# EasyEDA schematic Drop_sensor.json
TITLE: Drop_sensor for water drop screen and/or UV cure exhebit; REV: 1.0; Date: 2022-09-07; Sheet: 1/1; Drawn By: AmirB; Company: Your Company
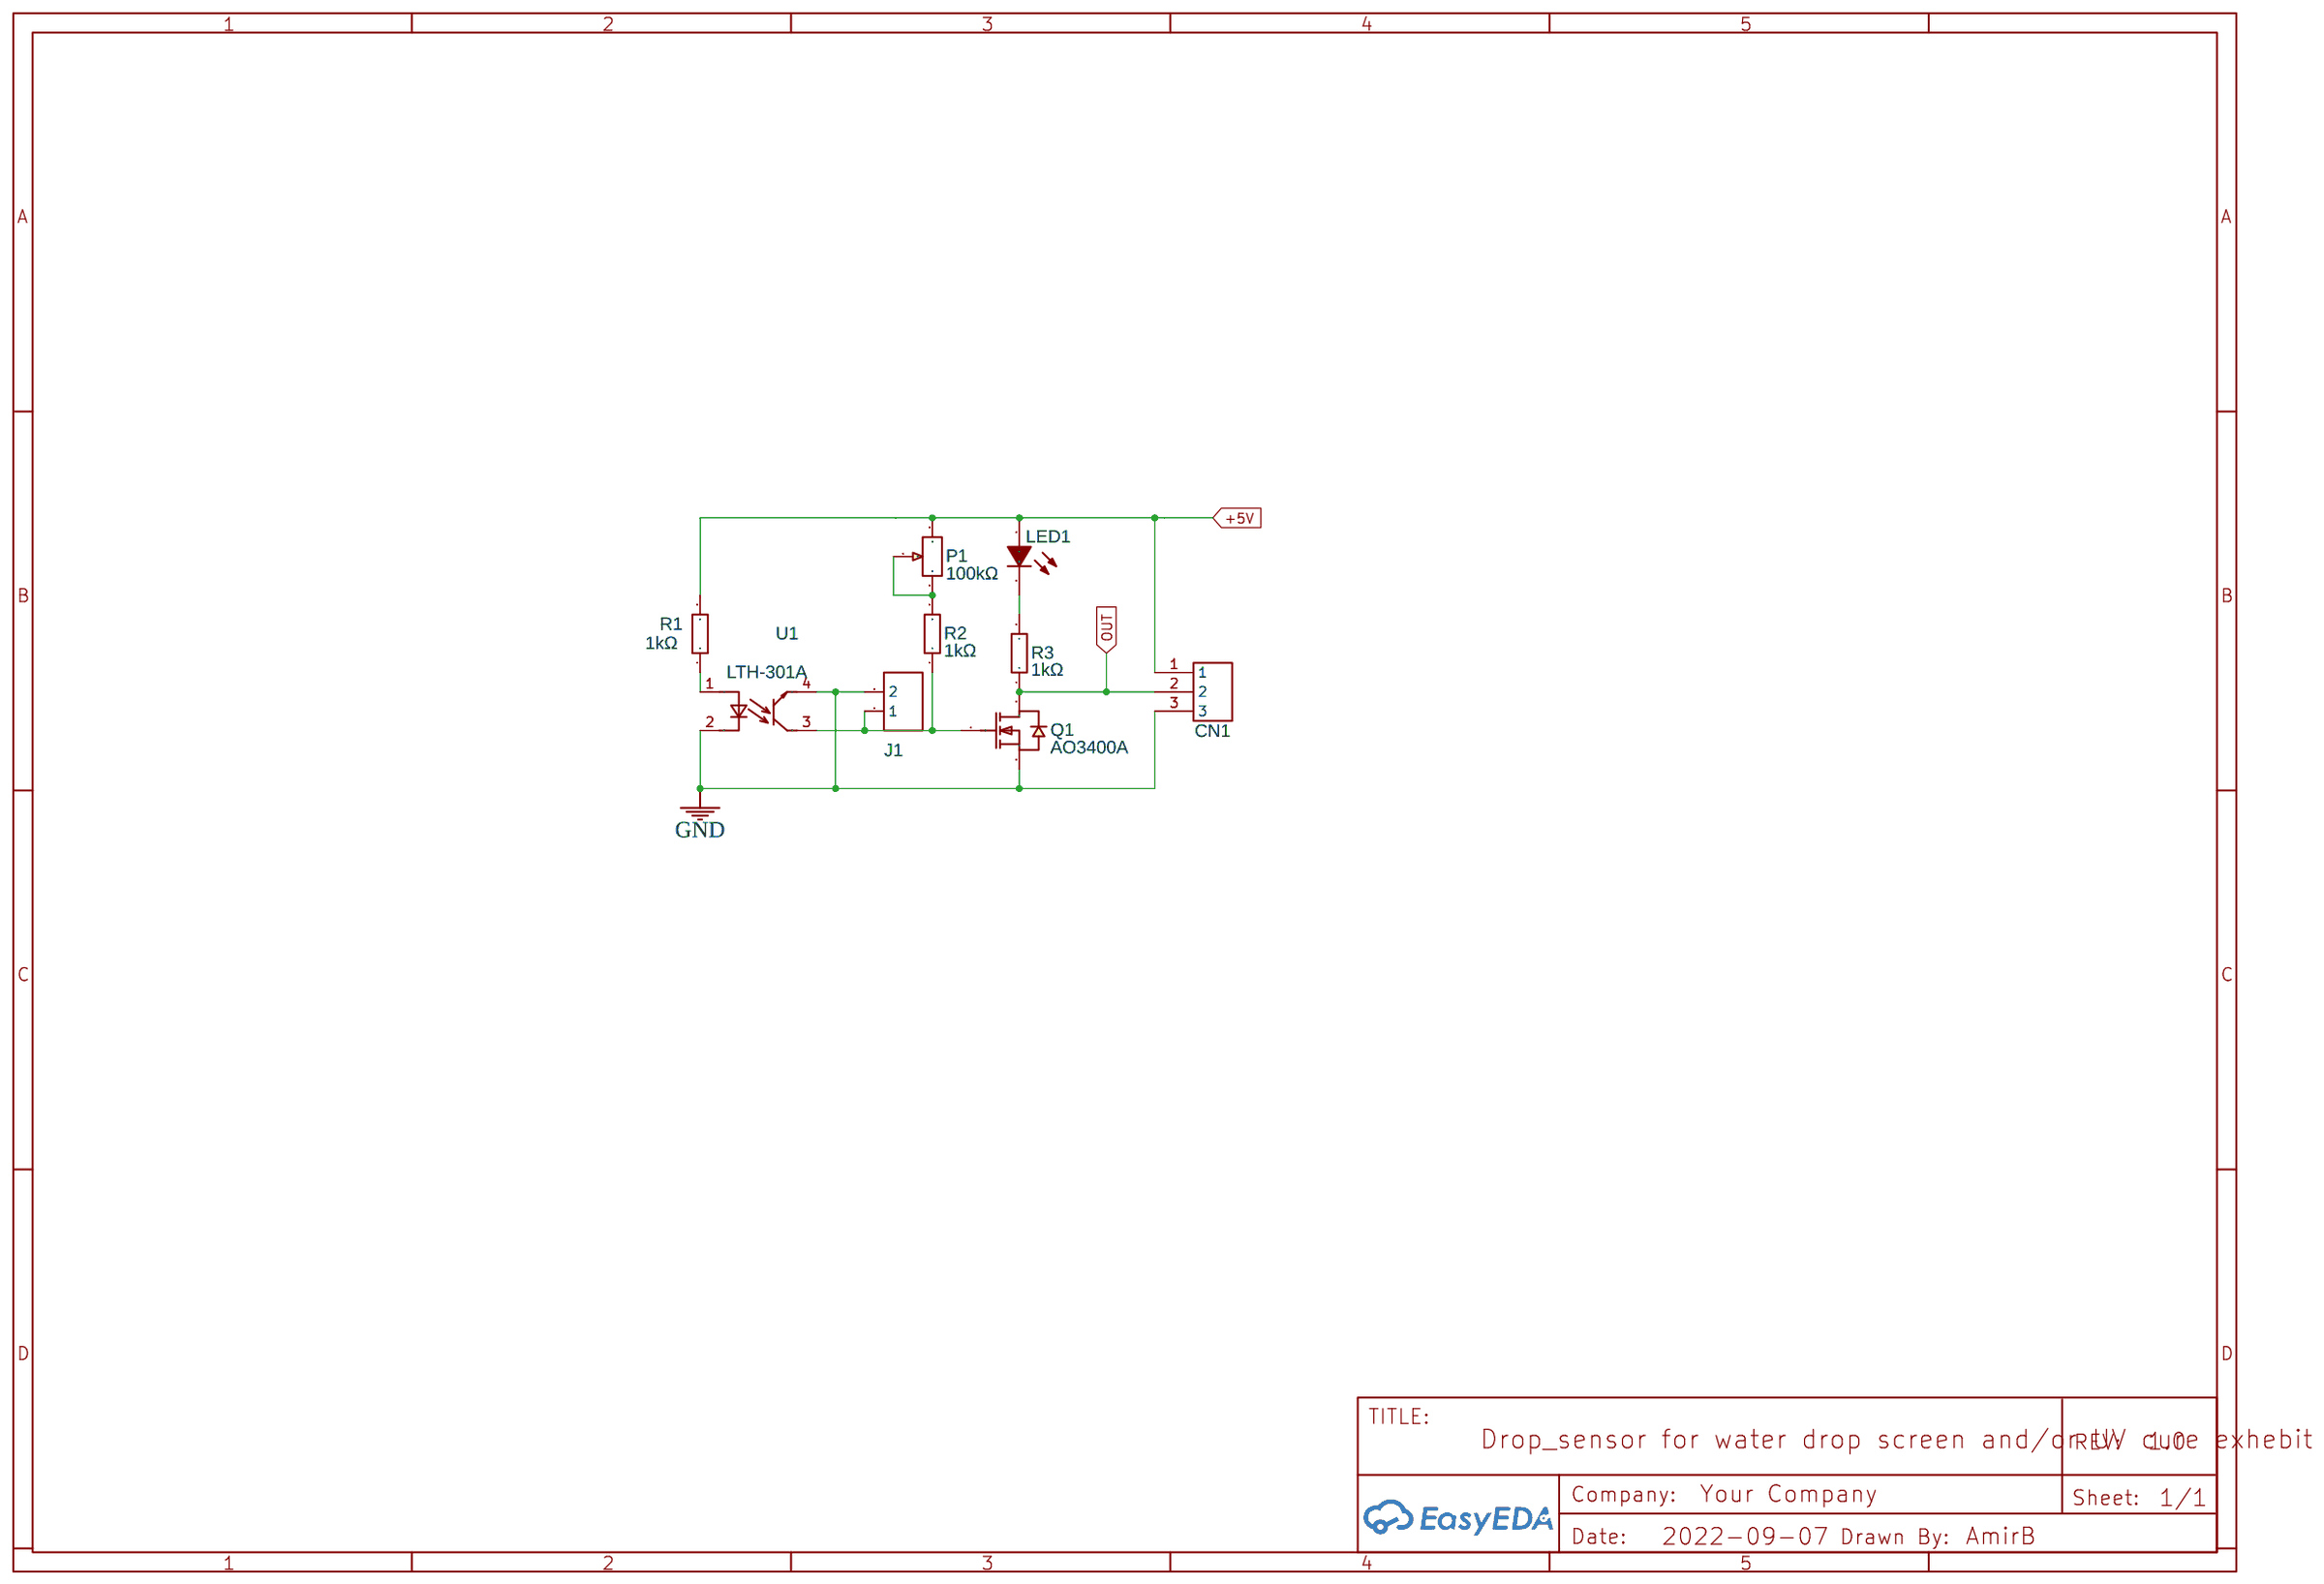
[diagram p0: schematic sheet]

## Parts
CN1  XHB-3A  [CONN-TH_XHB-3A]
J1  HDR-M-2.54_1x2  [HDR-M-2.54_1X2]
LED1  19-217/BHC-ZL1M2RY/3T  [LED0603-R-RD_BLUE]
P1  100kΩ  [RES-ADJ-TH_3P-L9.5-W4.9-P2.50-L_3296W]
Q1  AO3400A  [SOT-23-3_L2.9-W1.6-P1.90-LS2.8-BR]
R1  1kΩ  [R0603]
R2  1kΩ  [R0603]
R3  1kΩ  [R0603]
U1  LTH-301A  [OPTO-TH_LTH-301A]

## Library data of the parts
CN1 = XHB-3A: Supplier: LCSC; Manufacturer: BOOMELE; Supplier Part: C68817; JLCPCB Part Class: Extended Part; Package Display: No
J1 = HDR-M-2.54_1x2: Supplier Part: C124375; Supplier: LCSC; Contributor: LCEDA_Lib; Package Display: No
LED1 = 19-217/BHC-ZL1M2RY/3T: Supplier: LCSC; Manufacturer: EVERLIGHT; Supplier Part: C72041; JLCPCB Part Class: Basic Part; Package Display: No
P1 = 3296W-1-104: Supplier: LCSC; Supplier Part: C118963; Manufacturer: Chengdu Guosheng Tech; Resistance(Ohms): 100K; Contributor: LCSC; Resistance (Ohms): 100K; JLCPCB Part Class: Extended Part; Package Display: No
Q1 = AO3400A: Supplier: LCSC; Manufacturer: AOS; Supplier Part: C20917; JLCPCB Part Class: Basic Part; Package Display: No
R1-R3 = 0603WAF1001T5E: Supplier: LCSC; Manufacturer: UniOhm; Supplier Part: C21190; Resistance (Ohms): 1K; JLCPCB Part Class: Basic Part; Package Display: No
U1 = LTH-301A: Supplier: LCSC; Supplier Part: C115445; Manufacturer: Lite-On; Contributor: LCSC; JLCPCB Part Class: Extended Part; Package Display: No

## Nets
+5V: CN1.1 LED1.1(A) P1.3 R1.2
GND: CN1.3 J1.2 Q1.2(S) U1.2 U1.4
OUT: CN1.2 Q1.3(D) R3.1
Net-(J1-1): J1.1 Q1.1(G) R2.1 U1.3
Net-(LED1-2): LED1.2(C) R3.2
Net-(P1-1): P1.1 P1.2 R2.2
Net-(R1-1): R1.1 U1.1
